# EAGLE schematic recnt (EAGLE 9.6.2)
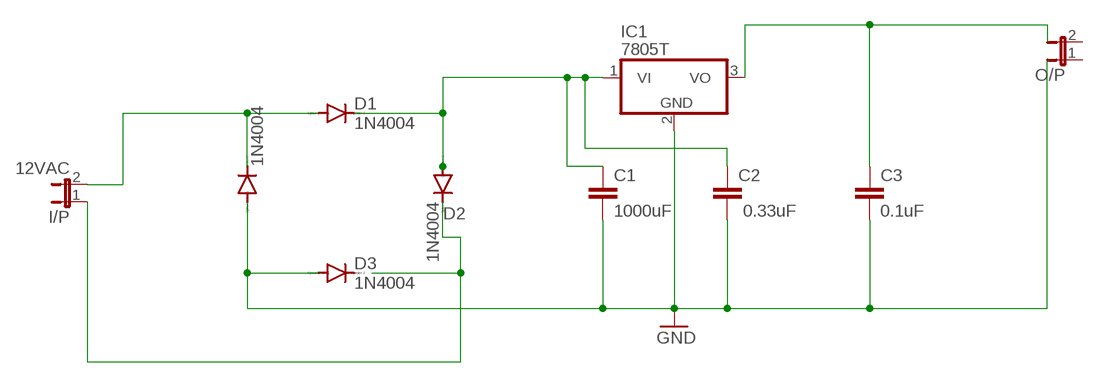
[diagram p0: schematic, sheet 1]

## Parts
C1  1000uF  C2,5-3  [C2.5-3]
C2  0.33uF  C2,5-3  [C2.5-3]
C3  0.1uF  C2,5-3  [C2.5-3]
D1  1N4004  [DO41-10]
D2  1N4004  [DO41-10]
D3  1N4004  [DO41-10]
D4  1N4004  [DO41-10]
I/P  12VAC  JP1E  [JP1]
IC1  7805T  [TO220H]
O/P  JP1E  [JP1]

## Nets
D2: D2.C I/P.1
GND: C1.2 C2.2 C3.2 D3.A D4.A IC1.2(GND)
N$1: D1.A D4.C I/P.2
N$5: C1.1 C2.1 D1.C D2.A IC1.1(VI)
N$6: C3.1 IC1.3(VO)
Unconnected: D3.C O/P.1 O/P.2

## Library data of the parts
C1-C3 = capacitor-wima:C: CAPACITOR naming: grid - package width
D1-D4 = diode:1N4004: DIODE general purpose rectifier, 1 A
I/P O/P = jumper:JP1E: JUMPER
IC1 = linear:78*: Positive VOLTAGE REGULATOR Source: http://cache.national.com/ds/LM/LM78L05.pdf http://www.fairchildsemi.com/ds/LM/LM7805.pdf